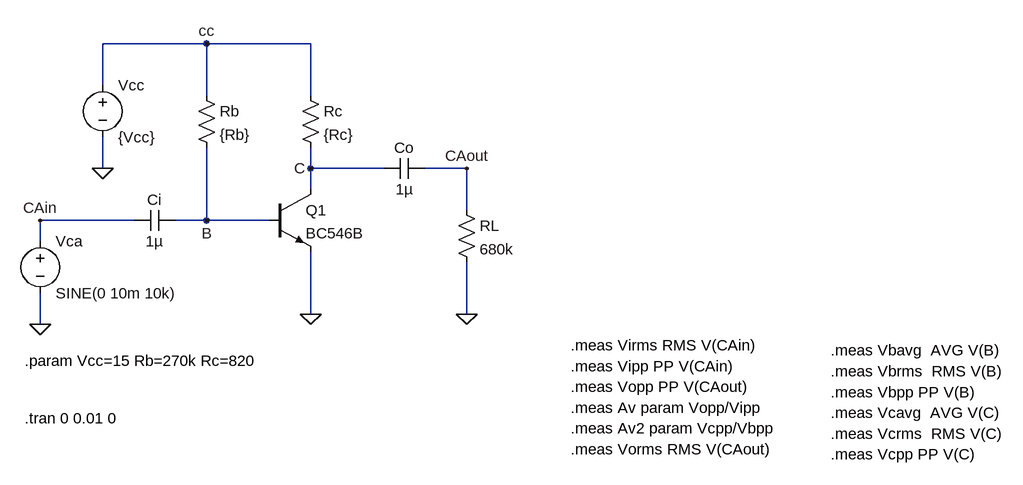
[diagram p0: schematic TBJ01CA.asc]
TBJ01CA.asc, the LTspice schematic file:
Version 4
SHEET 1 1656 1092
WIRE 128 -16 -32 -16
WIRE 288 -16 128 -16
WIRE -32 48 -32 -16
WIRE 128 64 128 -16
WIRE 288 64 288 -16
WIRE -32 176 -32 128
WIRE 288 176 288 144
WIRE 400 176 288 176
WIRE 528 176 464 176
WIRE 288 208 288 176
WIRE 528 240 528 176
WIRE 16 256 -128 256
WIRE 128 256 128 144
WIRE 128 256 80 256
WIRE 224 256 128 256
WIRE -128 288 -128 256
WIRE 288 400 288 304
WIRE 528 400 528 320
WIRE -128 416 -128 368
FLAG -32 176 0
FLAG 288 400 0
FLAG -128 416 0
FLAG 128 -16 cc
FLAG -128 256 CAin
FLAG 528 400 0
FLAG 528 176 CAout
FLAG 128 256 B
FLAG 288 176 C
SYMBOL res 112 48 R0
SYMATTR InstName Rb
SYMATTR Value {Rb}
SYMBOL res 272 48 R0
SYMATTR InstName Rc
SYMATTR Value {Rc}
SYMBOL voltage -32 32 R0
WINDOW 123 0 0 Left 0
WINDOW 39 0 0 Left 0
SYMATTR InstName Vcc
SYMATTR Value {Vcc}
SYMBOL npn 224 208 R0
SYMATTR InstName Q1
SYMATTR Value BC546B
SYMBOL cap 80 240 R90
WINDOW 0 0 32 VBottom 2
WINDOW 3 32 32 VTop 2
SYMATTR InstName Ci
SYMATTR Value 1µ
SYMBOL cap 464 160 R90
WINDOW 0 0 32 VBottom 2
WINDOW 3 32 32 VTop 2
SYMATTR InstName Co
SYMATTR Value 1µ
SYMBOL voltage -128 272 R0
WINDOW 123 0 0 Left 0
WINDOW 39 0 0 Left 0
SYMATTR InstName Vca
SYMATTR Value SINE(0 10m 10k)
SYMBOL res 512 224 R0
SYMATTR InstName RL
SYMATTR Value 680k
TEXT -152 560 Left 2 !.tran 0 0.01 0
TEXT -152 472 Left 2 !.param Vcc=15 Rb=270k Rc=820
TEXT 688 480 Left 2 !.meas Vipp PP V(CAin)
TEXT 688 512 Left 2 !.meas Vopp PP V(CAout)
TEXT 688 544 Left 2 !.meas Av param Vopp/Vipp
TEXT 688 448 Left 2 !.meas Virms RMS V(CAin)
TEXT 1088 520 Left 2 !.meas Vbpp PP V(B)
TEXT 1088 488 Left 2 !.meas Vbrms  RMS V(B)
TEXT 1088 456 Left 2 !.meas Vbavg  AVG V(B)
TEXT 1088 616 Left 2 !.meas Vcpp PP V(C)
TEXT 1088 584 Left 2 !.meas Vcrms  RMS V(C)
TEXT 1088 552 Left 2 !.meas Vcavg  AVG V(C)
TEXT 688 576 Left 2 !.meas Av2 param Vcpp/Vbpp
TEXT 688 608 Left 2 !.meas Vorms RMS V(CAout)

The netlist it stands for:
* TBJ01CA.asc
Rb cc B {Rb}
Rc cc C {Rc}
Vcc cc 0 {Vcc}
Q1 C B 0 0 BC546B
Ci B CAin 1µ
Co CAout C 1µ
Vca CAin 0 SINE(0 10m 10k)
RL CAout 0 680k
.model NPN NPN
.model PNP PNP
.lib standard.bjt
.tran 0 0.01 0
.param Vcc=15 Rb=270k Rc=820
.meas Vipp PP V(CAin)
.meas Vopp PP V(CAout)
.meas Av param Vopp/Vipp
.meas Virms RMS V(CAin)
.meas Vbpp PP V(B)
.meas Vbrms  RMS V(B)
.meas Vbavg  AVG V(B)
.meas Vcpp PP V(C)
.meas Vcrms  RMS V(C)
.meas Vcavg  AVG V(C)
.meas Av2 param Vcpp/Vbpp
.meas Vorms RMS V(CAout)
.backanno
.end